# EAGLE design 0.1 (EAGLE 9.4.2)
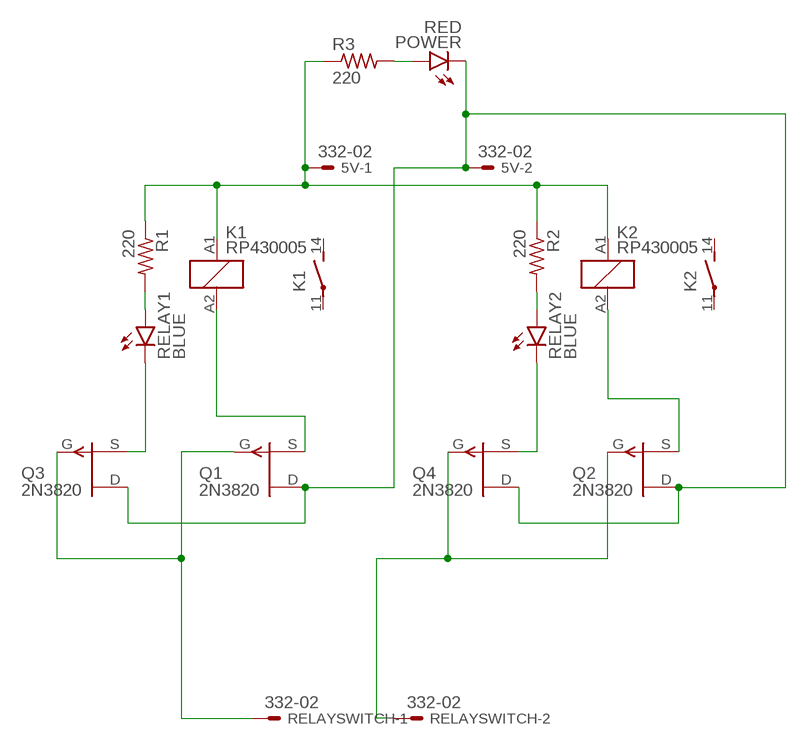
[diagram p0: schematic, sheet 1]

## Parts
5V  332-02  [332-02]
K1  RP430005  [RT-N/O12A5]
K2  RP430005  [RT-N/O12A5]
POWER  RED  LED5MM  [LED5MM]
Q1  2N3820  [TO92]
Q2  2N3820  [TO92]
Q3  2N3820  [TO92]
Q4  2N3820  [TO92]
R1  220  R-US_0204/7  [0204/7]
R2  220  R-US_0204/7  [0204/7]
R3  220  R-US_0204/7  [0204/7]
RELAY1  BLUE  LED5MM  [LED5MM]
RELAY2  BLUE  LED5MM  [LED5MM]
RELAYSWITCH  332-02  [332-02]

## Nets
5V: 5V.1 K1.A1 K2.A1 R1.1 R2.1 R3.1
GROUND: 5V.2 POWER.K(C) Q1.3(D) Q2.3(D) Q3.3(D) Q4.3(D)
N$3: K1.A2 Q1.1(S)
N$7: K2.A2 Q2.1(S)
N$11: Q3.1(S) RELAY1.K(C)
N$12: Q4.1(S) RELAY2.K(C)
N$13: POWER.A R3.2
RELAYLED1: R1.2 RELAY1.A
RELAYLED2: R2.2 RELAY2.A
RELAYSWITCH1: Q1.2(G) Q3.2(G) RELAYSWITCH.1
RELAYSWITCH2: Q2.2(G) Q4.2(G) RELAYSWITCH.2
Unconnected: K1.11(2:P) K1.14(2:S) K2.11(2:P) K2.14(2:S)

## Library data of the parts
5V RELAYSWITCH = con-garry:332-02: 2 Pin - 2mm Dual Row Source: www.mpe-connector.de / garry_shortform_2012.pdf
K1 K2 = relay:RP?30*: Power PCB Relay RP II/1 SCHRACK 1 pole 8 / 12 A Source: http://www.schrack.com/.. 5834.pdf; OC_FARNELL: unknown; OC_NEWARK: unknown
POWER RELAY1 RELAY2 = led:LED: LED OSRAM: - CHIPLED LG R971, LG N971, LY N971, LG Q971, LY Q971, LO R971, LY R971 LH N974, LH R974 LS Q976, LO Q976, LY Q976 LO Q996 - Hyper CHIPLED LW Q18S LB Q993, LB Q99A, LB R99A - SideLED LS A670, LO A670, LY A670, LG A670, LP A670 LB A673, LV A673, LT A673, LW A673 LH A674 LY A675 LS A676, LA A676, LO A676, LY A676, LW A676 LS A679, LY A679, LG A679 - Hyper Micro SIDELED® LS Y876, LA Y876, LO Y876, LY Y876 LT Y87S - SmartLED LW L88C, LW L88S LB L89C, LB L89S, LG L890 LS L89K, LO L89K, LY L89K LS L896, LA L896, LO L896, LY L896 - TOPLED LS T670, LO T670, LY T670, LG T670, LP T670 LSG T670, LSP T670, LSY T670, LOP T670, LYG T670 LG T671, LOG T671, LSG T671 LB T673, LV T673, LT T673, LW T673 LH T674 LS T676, LA T676, LO T676, LY T676, LB T676, LH T676, LSB T676, LW T676 LB T67C, LV T67C, LT T67C, LS T67K, LO T67K, LY T67K, LW E67C LS E67B, LA E67B, LO E67B, LY E67B, LB E67C, LV E67C, LT E67C LW T67C LS T679, LY T679, LG T679 LS T770, LO T770, LY T770, LG T770, LP T770 LB T773, LV T773, LT T773, LW T773 LH T774 LS E675, LA E675, LY E675, LS T675 LS T776, LA T776, LO T776, LY T776, LB T776 LHGB T686 LT T68C, LB T68C - Hyper Mini TOPLED® LB M676 - Mini TOPLED Santana® LG M470 LS M47K, LO M47K, LY M47K Source: http://www.osram.convergy.de LUXEON: - LUMILED® LXK2-PW12-R00, LXK2-PW12-S00, LXK2-PW14-U00, LXK2-PW14-V00 LXK2-PM12-R00, LXK2-PM12-S00, LXK2-PM14-U00 LXK2-PE12-Q00, LXK2-PE12-R00, LXK2-PE12-S00, LXK2-PE14-T00, LXK2-PE14-U00 LXK2-PB12-K00, LXK2-PB12-L00, LXK2-PB12-M00, LXK2-PB14-N00, LXK2-PB14-P00, LXK2-PB14-Q00 LXK2-PR12-L00, LXK2-PR12-M00, LXK2-PR14-Q00, LXK2-PR14-R00 LXK2-PD12-Q00, LXK2-PD12-R00, LXK2-PD12-S00 LXK2-PH12-R00, LXK2-PH12-S00 LXK2-PL12-P00, LXK2-PL12-Q00, LXK2-PL12-R00 Source: www.luxeon.com KINGBRIGHT: KA-3528ASYC Source: www.kingbright.com
Q1-Q4 = transistor-fet:2N3820: P-Channel Junction FET Source: http://www.fairchildsemi.com/ds/2N/2N3820.pdf
R1-R3 = rcl:R-US_: RESISTOR, American symbol; SPICEPREFIX: R

## Board
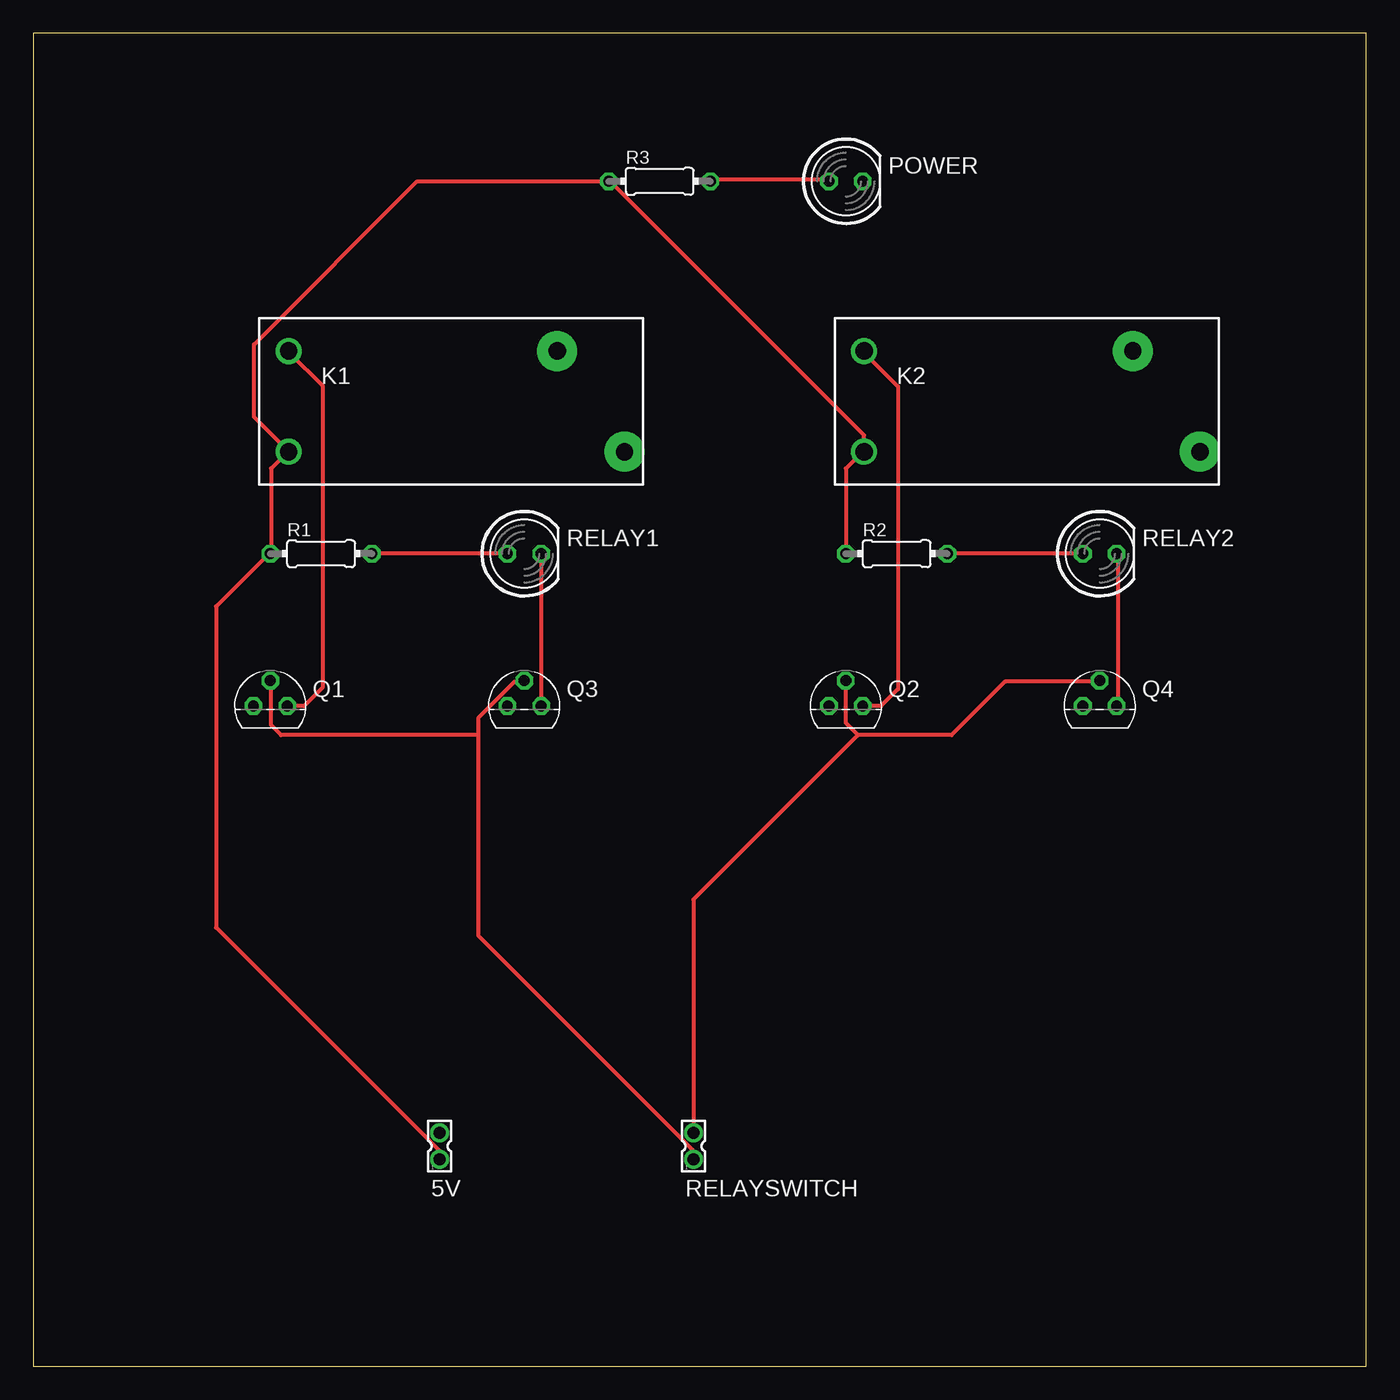
[diagram p1: board, top side]
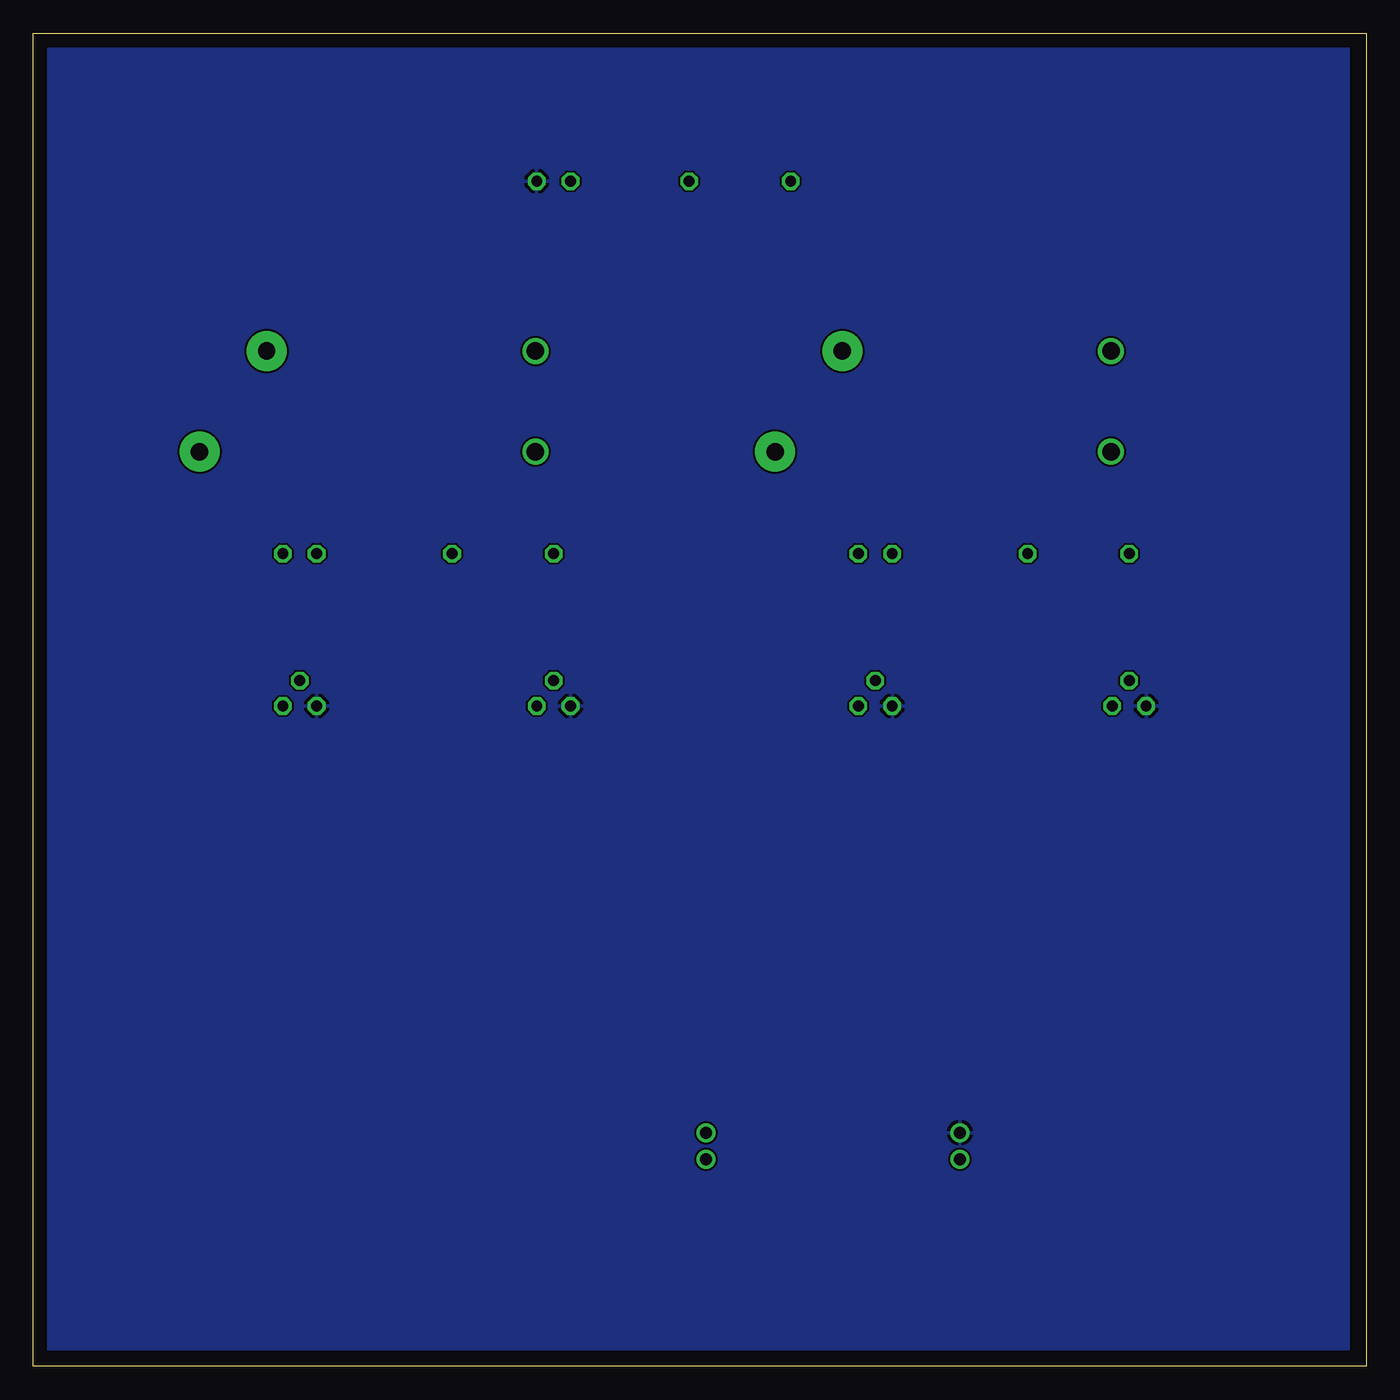
[diagram p2: board, bottom side, seen from below]

Size 100 x 100 mm. Coordinates in mm from the lower left corner, seen from the top.
Outline: 0,0 100,0 100,100 0,100 0,0
Copper layers (1*16): Top 0.035mm / dielectric 1.5mm / Bottom 0.035mm
Design rules "default": minimum track width 6mil, minimum drill 0.35mm, track to track 6mil, track to pad 6mil, pad to pad 6mil, via to via 6mil, smd to smd 6mil, copper to edge 40mil, drill to drill 6mil, minimum pad ring 10mil, minimum via ring 8mil, stop-mask expansion 4mil, vias tented up to drill 0mil, thermal gap 10mil

### Footprints (pad centres in the part's own frame; a part is rotated, then mirrored left to right if it is on the bottom)
332-02 = drill 0.9 pad 1.27: 1 0,-1; 2 0,1
RT-N/O12A5 = drill 1.3 pad 3: 11 7.56,3.78; 14 12.6,-3.78 | drill 1.3: A1 -12.6,-3.78; A2 -12.6,3.78
LED5MM = drill 0.813 octagon: A -1.27,0; K 1.27,0
TO92 = drill 0.813 octagon: 1 1.27,0; 2 0,1.905; 3 -1.27,0
0204/7 = drill 0.813 octagon: 1 -3.81,0; 2 3.81,0

### Placement (x,y rotation side)
5V  30.48,16.51 0 top
K1  31.75,72.39 0 top
K2  74.93,72.39 0 top
POWER  60.96,88.9 0 top
Q1  17.78,49.53 0 top
Q2  60.96,49.53 0 top
Q3  36.83,49.53 0 top
Q4  80.01,49.53 0 top
R1  21.59,60.96 0 top
R2  64.77,60.96 0 top
R3  46.99,88.9 0 top
RELAY1  36.83,60.96 0 top
RELAY2  80.01,60.96 0 top
RELAYSWITCH  49.53,16.51 0 top

### Tracks (layer width: path | path; a pad name or v marks a point on that pad's centre or on a via)
5V
  Top 0.152: 62.18,68.58 K2.A1 | 43.24,88.87 R3.1 | 17.83,60.96 R1.1 17.68,60.96 | 19.05,68.58 K1.A1 19.05,68.73 | 30.48,16.15 5V.1
  Top 0.305: R2.1 60.96,67.36 62.18,68.58 | 43.28,88.9 43.24,88.87 | K2.A1 62.33,69.85 43.28,88.9 | 17.83,60.96 17.83,67.36 19.05,68.58 | 30.48,16.15 13.72,32.92 13.72,57 17.68,60.96 | 43.28,88.9 28.8,88.9 16.56,76.66 16.56,71.22 19.05,68.73
GROUND
  pour Bottom: 1.27,99.06 99.06,99.06 99.06,1.27 1.27,1.27
N$3
  Top 0.152: 19.2,76.05 K1.A2
  Top 0.305: Q1.1 20.32,49.53 21.69,50.9 21.69,73.56 19.2,76.05
N$7
  Top 0.152: 62.33,76.05 K2.A2
  Top 0.305: 62.33,76.05 64.87,73.51 64.87,50.8 63.6,49.53 Q2.1
N$11
  Top 0.305: RELAY1.K Q3.1
N$12
  Top 0.152: 81.38,49.53 Q4.1 | 81.38,60.96 RELAY2.K
  Top 0.305: 81.38,60.96 81.38,49.53
N$13
  Top 0.152: 50.9,89 R3.2 | 59.59,89 POWER.A
  Top 0.305: 59.59,89 50.9,89
RELAYLED1
  Top 0.305: RELAY1.A R1.2
RELAYLED2
  Top 0.305: RELAY2.A R2.2
RELAYSWITCH1
  Top 0.152: 36.12,51.36 36.73,51.36 Q3.2 | 17.83,51.36 Q1.2 | 49.53,16.15 RELAYSWITCH.1
  Top 0.305: 17.83,51.36 17.83,48.11 18.59,47.35 33.38,47.35 | 36.12,51.36 33.38,48.62 33.38,47.35 | 49.53,16.15 33.38,32.31 33.38,47.35
RELAYSWITCH2
  Top 0.152: 80.01,51.36 Q4.2
  Top 0.305: Q2.2 60.96,48.26 61.87,47.35 | 61.87,47.35 68.89,47.35 72.9,51.36 80.01,51.36 | RELAYSWITCH.2 49.53,35 61.87,47.35